# Altium schematic sheet sensor.SchDoc
size A4
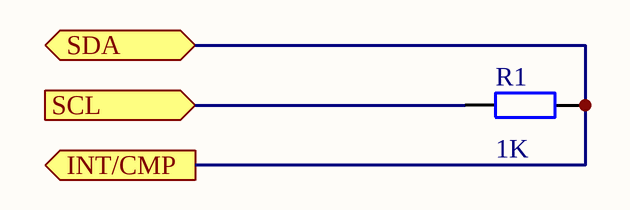
[diagram p0: sensor.SchDoc]

## Parts
R1  value 1K  [AXIAL-0.4]  (hidden comment: Res2)

## Ports
INT/CMP (out), SCL (in), SDA (bidir)

## Nets
INT/CMP: R1.2 ; port SDA, port INT/CMP
SCL: R1.1 ; port SCL

## Library data of the parts
R1 = Res2: Resistor; Published: 8-Jun-2000; LatestRevisionDate: 17-Jul-2002; LatestRevisionNote: Re-released for DXP Platform.; PackageReference: AXIAL-0.4; Publisher: Altium Limited; PackageDescription: Axial Device, Thru-Hole; 2 Leads; 0.4 in Pin Spacing